# Altium project PCB_Project_MPPT.PrjPcb
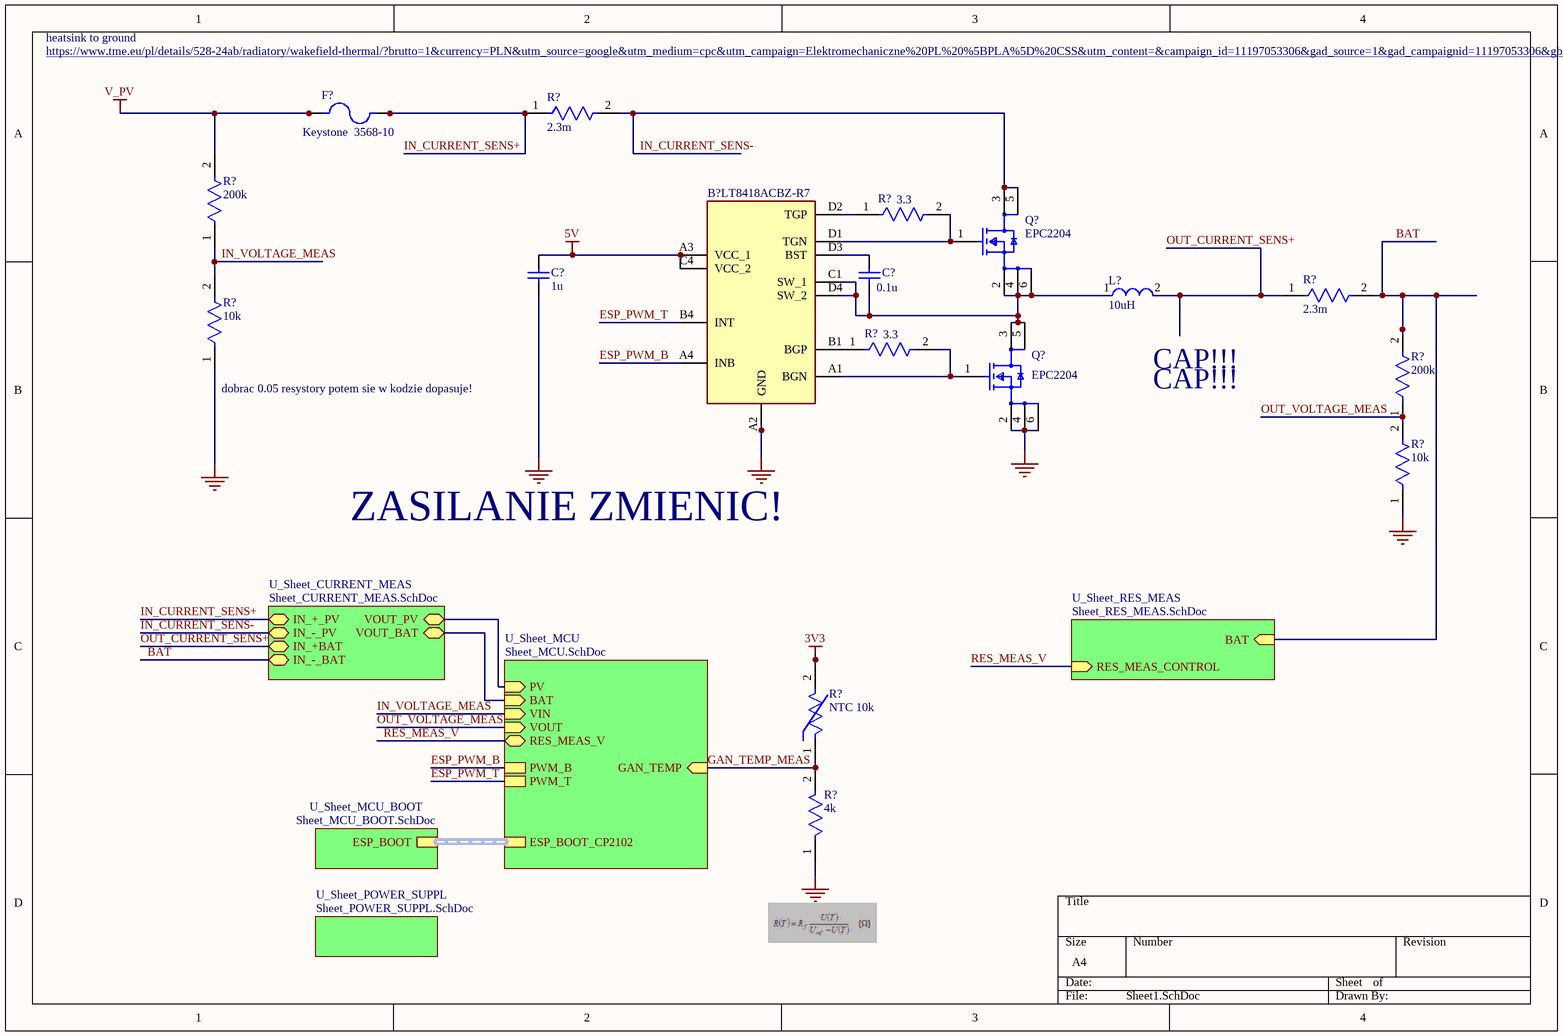
[diagram p0: Sheet1.SchDoc]
7 sheets, 71 parts. Net scope: hierarchical (ports join the sheet entries above them; power ports are global).
Sheets:
  Sheet1.SchDoc
    U_Sheet_MCU = Sheet_MCU.SchDoc
    U_Sheet_MCU_BOOT = Sheet_MCU_BOOT.SchDoc
    U_Sheet_CURRENT_MEAS = Sheet_CURRENT_MEAS.SchDoc
    U_Sheet_POWER_SUPPL = Sheet_POWER_SUPPL.SchDoc
    U_Sheet_RES_MEAS = Sheet_RES_MEAS.SchDoc
  Scheet_MCUBOOT_esp32s3.SchDoc

## Sheet Sheet1.SchDoc
size A4; SheetNumber: 1; SheetTotal: 7

### Parts
(Parts that share a designator on the sheet are numbered #1, #2 ... from top to bottom, then left to right.)
B?#1  LT8418ACBZ-R7  [BGA12C40P4X4_167X167X56]
C?#1  1u  [CAPC2013X140X50LL20T25]
C?#2  0.1u  [CAPC2013X140X45LL15T25]
F?  Keystone  3568-10  [FUSE_3568-10]
L?#1  10uH  [FP-IHLP-5050EZ-FP_3_226x4-MFG]
Q?#1  EPC2204  [FP-EPC2204-MFG]
Q?#2  EPC2204  [FP-EPC2204-MFG]
R?#1  2.3m  [FP-WSLF2512-1_02-MFG]
R?#2  3.3  [FP-ESR10-IPC_A]
R?#3  200k  [FP-RT0805-MFG]
R?#4  2.3m  [FP-WSLF2512-1_02-MFG]
R?#5  3.3  [FP-ESR10-IPC_A]
R?#6  10k  [FP-RT0805-MFG]
R?#7  200k  [FP-RT0805-MFG]
R?#8  10k  [FP-RT0805-MFG]
R?#9  NTC 10k  [FP-NCP21-0_2-IPC_C]
R?#10  4k  [FP-RN732A-MFG]

### Sub-sheets
U_Sheet_CURRENT_MEAS = Sheet_CURRENT_MEAS.SchDoc: IN_+_PV (bidir), IN_-_PV (bidir), IN_+BAT (bidir), IN_-_BAT (bidir), VOUT_PV (bidir), VOUT_BAT (bidir)
U_Sheet_MCU = Sheet_MCU.SchDoc: ESP_BOOT_CP2102 (harness ESP_BOOT_CP2102), PV (in), VIN (in), VOUT (in), BAT (in), RES_MEAS_V (bidir), PWM_B, PWM_T, GAN_TEMP (in)
U_Sheet_MCU_BOOT = Sheet_MCU_BOOT.SchDoc: ESP_BOOT (harness ESP_BOOT_CP2102)
U_Sheet_POWER_SUPPL = Sheet_POWER_SUPPL.SchDoc: no entries
U_Sheet_RES_MEAS = Sheet_RES_MEAS.SchDoc: RES_MEAS_CONTROL (in), BAT (in)

### Nets
3V3: R?#9.2
5V: B?#1.A3(VCC_1) B?#1.C4(VCC_2) C?#1.2
GND: B?#1.A2(GND) C?#1.1 Q?#2.2(Source) Q?#2.4(Source) Q?#2.6(Source) R?#6.1 R?#8.1 R?#10.1
V_PV: F?.1 F?.3 R?#3.2
BAT: R?#4.2 R?#7.2 ; sheet U_Sheet_CURRENT_MEAS/IN_-_BAT, sheet U_Sheet_RES_MEAS/BAT
ESP_PWM_B: B?#1.A4(INB) ; sheet U_Sheet_MCU/PWM_B
ESP_PWM_T: B?#1.B4(INT) ; sheet U_Sheet_MCU/PWM_T
GAN_TEMP_MEAS: R?#9.1 R?#10.2 ; sheet U_Sheet_MCU/GAN_TEMP
IN_CURRENT_SENS+: F?.2 F?.4 R?#1.1 ; sheet U_Sheet_CURRENT_MEAS/IN_+_PV
IN_CURRENT_SENS-: Q?#1.3(Drain) Q?#1.5(Drain) R?#1.2 ; sheet U_Sheet_CURRENT_MEAS/IN_-_PV
IN_VOLTAGE_MEAS: R?#3.1 R?#6.2 ; sheet U_Sheet_MCU/VIN
OUT_CURRENT_SENS+: L?#1.2 R?#4.1 ; sheet U_Sheet_CURRENT_MEAS/IN_+BAT
OUT_VOLTAGE_MEAS: R?#7.1 R?#8.2 ; sheet U_Sheet_MCU/VOUT
RES_MEAS_V: sheet U_Sheet_MCU/RES_MEAS_V, sheet U_Sheet_RES_MEAS/RES_MEAS_CONTROL  [project net RES_MEAS_CONTROL]
NetB?#1_A1: B?#1.A1(BGN) Q?#2.1(Gate) R?#5.2
NetB?#1_B1: B?#1.B1(BGP) R?#5.1
NetB?#1_C1: B?#1.C1(SW_1) B?#1.D4(SW_2) C?#2.1 L?#1.1 Q?#1.2(Source) Q?#1.4(Source) Q?#1.6(Source) Q?#2.3(Drain) Q?#2.5(Drain)
NetB?#1_D1: B?#1.D1(TGN) Q?#1.1(Gate) R?#2.2
NetB?#1_D2: B?#1.D2(TGP) R?#2.1
NetB?#1_D3: B?#1.D3(BST) C?#2.2
NetU?#2_8: sheet U_Sheet_MCU/PV, sheet U_Sheet_CURRENT_MEAS/VOUT_PV
NetU?#2_9: sheet U_Sheet_MCU/BAT, sheet U_Sheet_CURRENT_MEAS/VOUT_BAT

### Buses and harness runs
harness sheet U_Sheet_MCU/ESP_BOOT_CP2102 = sheet U_Sheet_MCU_BOOT/ESP_BOOT

### Notes on the sheet
- heatsink to ground
- https://www.tme.eu/pl/details/528-24ab/radiatory/wakefield-thermal/?brutto=1&currency=PLN&utm_source=google&utm_medium=cpc&utm_campaign=Elektromechaniczne%20PL%20%5BPLA%5D%20CSS&utm_content=&campaign_id=11197053306&gad_source=1&gad_campaignid=11197053306&gbraid=0AAAAADyylhLZbvY-cskZoRzBLKTwpPTA7&gclid=Cj0KCQiA2bTNBhDjARIsAK89wlHUc6paiocvVZBOlYyiqLQ5ZEe9kHkqtYY_EUCSDrDoMr3ZsjBrI2saAg7CEALw_wcB
- (near L?#1) CAP!!!
- (near R?#6) dobrac 0.05 resystory potem sie w kodzie dopasuje!
- CAP!!!
- ZASILANIE ZMIENIC!

### Library data of the parts
B?#1 = LT8418ACBZ-R7: 100V Half-Bridge GaN Driver with Smart Integrated Bootstrap Switch; Manufacturer_Name: Analog Devices; Geometry.Height: 0.56mm; Manufacturer_Part_Number: LT8418ACBZ-R7; Mouser Part Number: 584-LT8418ACBZ-R7; Mouser Price/Stock: https://www.mouser.co.uk/ProductDetail/Analog-Devices/LT8418ACBZ-R7?qs=mELouGlnn3eZ%252BVjhQJercg%3D%3D; Arrow Part Number: LT8418ACBZ-R7; Arrow Price/Stock: https://www.arrow.com/en/products/lt8418acbz-r7/analog-devices?utm_currency=USD&region=nac; Datasheet Link: https://www.analog.com/LT8418/datasheet
C?#1 = CMP-1036-04749-2: Manufacturer: Kemet; Part Number: C0805C105M4RACTU
C?#2 = CMP-2007-03344-1: Part Number: GCM21BR71E104KA37L; Manufacturer: Murata
F? = 3568-10: Holder,THM-Vertical Entry,Mini Automotive Fuse Holder,30 Amps,1 Fuse,Red | Keystone Electronics 3568-10; SnapEDA_Link: https://www.snapeda.com/parts/3568-10/Keystone/view-part/?ref=snap; Package: None; Value: *; MF: Keystone; MP: 3568-10; Check_prices: https://www.snapeda.com/parts/3568-10/Keystone/view-part/?ref=eda
L?#1 = CMP-02424-000353-1: Commercial Inductors, High Saturation Series 10uH 9A 25.5mΩ 20%; Self Resonant Frequency: 5MHz; DC Resistance (DCR): 25.5mR; Max DC Current: 16A; Core Material: Metal; Shielding: Shielded; Test Frequency: 100kHz; Height: 5mm; Width: 12.9mm; Current Rating: 9A; Number of Pins: 2; Inductance Tolerance: 20%; Min Operating Temperature: -55°C; RMS Current (Irms): 9A; Radiation Hardening: No; Height - Seated (Max): 0.197inch; Length: 13.2mm; Saturation Current: 16A; Case/Package: 5050; Termination: SMD/SMT; Inductance: 10uH; Package Quantity: 250; Mount: Surface Mount; Packaging: Tape and Reel; Lead Free: Lead Free; Military Standard: Not; Tolerance: 20%; Depth: 12.9mm; Max Operating Temperature: 125°C
Q?#1 Q?#2 = CMP-166566-000012-1: TRANS GAN 100V DIE 5.6MOHM; RoHS Compliant: Yes
R?#1 R?#4 = CMP-00030-75451314-1: WSLF2512L3000FEA Res Metal Strip 2512 0.0003 Ohm 1% 6W ±200ppm/C Sulfur Resistant Pad SMD Automotive T/R; Power Rating: 10W; Resistance: 300µΩ; Temperature Coefficient: 200ppm/°C; Length: 6.35mm; Case/Package: 2512; NexarPartId: 75451314; Case Code (Imperial): 2512; RoHS: Compliant; Packaging: Cut Tape; Width: 3.175mm; Max Power Dissipation: 6W; Features: Moisture Resistant; Min Operating Temperature: -65°C; Schedule B: 8533210045, 8533210045; Max Operating Temperature: 170°C; Lead Free: Lead Free; Case Code (Metric): 6432; Composition: Metal Element; Number of Terminations: 2; Height: 609.6µm; Tolerance: 1%
R?#2 R?#5 = CMP-08839-000011-1: RES SMD 3.3 OHM 5% 0.4W 0805; Temperature Coefficient: 200ppm/°C; Max Power Dissipation: 400mW; Resistance: 3.3R; Lead Free: Lead Free; Number of Terminations: 2; Case Code (Imperial): 0805; Width: 0.049inch; Tolerance: 5%; Height: 0.026inch; Features: Automotive AEC-Q200; Package Quantity: 1; Case/Package: 0805; Min Operating Temperature: -55°C; Case Code (Metric): 2012; Composition: Thick Film; Length: 0.079inch; Max Operating Temperature: 155°C; Packaging: Tape and Reel
R?#3 R?#7 = CMP-2001-01542-2: RES 200K OHM 1/8W .1% SMD 0805; Manufacturer Part Number: RT0805BRE07200KL; Manufacturer: Yageo; Temperature Coefficient: 50 ppm/°C; Power Rating: 0.125W; Value: 200KΩ; Voltage Rating: 150V; Tolerance: 0.0025; Package: RT0805; Height: 0.6mm; Lead Free: Yes; Digikey Description: RES 200K OHM 1/8W .1% SMD 0805; Footprint Url: http://www.yageo.com/exep/pages/download/literatures/PYu-R_Mount_10.pdf; Temperature Range High: +155°C; ComponentLink2URL: http://www.yageo.com/documents/recent/PYu-RT_1-to-0.01_RoHS_L_9.pdf; Category: Res; ComponentLink2Description: Datasheet; Series: RT; Resistance: 200KΩ; Device Class L3: Chip SMD Resistors; Device Class L1: Passive Components; Composition: Thin Film; Ipc Land Pattern Name: RESC200125X50; Automotive: No; RoHS: TRUE; Octopart: https://octopart.com/rt0805bre07200kl-yageo-1220506; Temperature Range Low: -55°C; Temperature: -55°C to +155°C; Device Class L2: Resistors
R?#6 R?#8 = CMP-03412-013123-1: RES SMD 10K OHM 0.25% 1/8W 0805; Manufacturer Part Number: RT0805CRD0710KL; Manufacturer: Yageo; Value: 10KΩ; Voltage Rating: 150V; Tolerance: 0.005; Power Rating: 0.125W; Temperature Coefficient: 25 ppm/°C; Composition: Thin Film; Device Class L3: Chip SMD Resistors; Automotive: No; ComponentLink2Description: Datasheet; RoHS: TRUE; Temperature Range Low: -55°C; Footprint Url: http://www.yageo.com/exep/pages/download/literatures/PYu-R_Mount_10.pdf; Temperature Range High: +155°C; Digikey Description: RES SMD 10K OHM 0.25% 1/8W 0805; ComponentLink2URL: http://www.yageo.com/documents/recent/PYu-RT_1-to-0.01_RoHS_L_9.pdf; Octopart: https://octopart.com/rt0805crd0710kl-yageo-1253059; Device Class L2: Resistors; Lead Free: Yes; Height: 0.6mm; Temperature: -55°C to +155°C; Resistance: 10KΩ; Series: RT; Ipc Land Pattern Name: RESC200125X50; Category: Res; Device Class L1: Passive Components; Package: RT0805
R?#9 = CMP-2000-06827-2: THERMISTOR NTC 10KOHM 3900K 0805; Accuracy: 3%; Current Rating: 440uA; Power Rating: 200mW; Resistance: 10kR; Tolerance: 5%; Number of Pins: 2; Termination: SMD/SMT; Lead Free: Lead Free; Radiation Hardening: No; Mount: Surface Mount; Case Code (Metric): 2012; Depth: 1.25mm; Max Operating Temperature: 125°C; Height: 0.85mm; Case Code (Imperial): 0805; Package Quantity: 4000; Length: 2mm; Case/Package: 0805; Min Operating Temperature: -40°C; Packaging: Tape and Reel; Max Power Dissipation: 200mW; Thickness: 150um; REACH SVHC: No SVHC
R?#10 = CMP-03211-001183-1: SMD Chip Resistor, Thin Film, 22.1KΩ, 100 V, 0805 [2012 Metric], 100 mW, 0.1%, RN73 Series; Manufacturer Part Number: RN73C2A22K1BTDF; Manufacturer: TE Connectivity; Power Rating: 0.1W; Temperature Coefficient: 10ppm/°C; Voltage Rating: 100V; Package: RN732A; Lead Free: Yes; ComponentLink2URL: https://www.te.com/commerce/DocumentDelivery/DDEController?Action=showdoc&DocId=Data+Sheet%7F1773270%7FP%7Fpdf%7FEnglish%7FENG_DS_1773270_P.pdf%7F1676162-2; Temperature Range High: 155°C; Series: RN73; packaging: 1000 Reel; RoHS: TRUE; Automotive: No; Composition: Thin Film; Resistance: 22.1KΩ; Ipc Land Pattern Name: RESC200125X55; Category: Res; octopart_url: https://octopart.com/rn73c2a22k1btdf-te+connectivity-41129296; Device Class L2: Resistors; Device Class L3: Chip SMD Resistors; Value: 22.1KΩ; Device Class L1: Passive Components; Height: 0.65mm; Temperature Range Low: -55°C; ComponentLink2Description: Datasheet; Octopart: https://octopart.com/rn73c2a22k1btdf-te+connectivity-41129296; Tolerance: 0.1%; Temperature: -55°C to 155°C

## Sheet Sheet_MCU.SchDoc
size A4; SheetNumber: 2; SheetTotal: 5
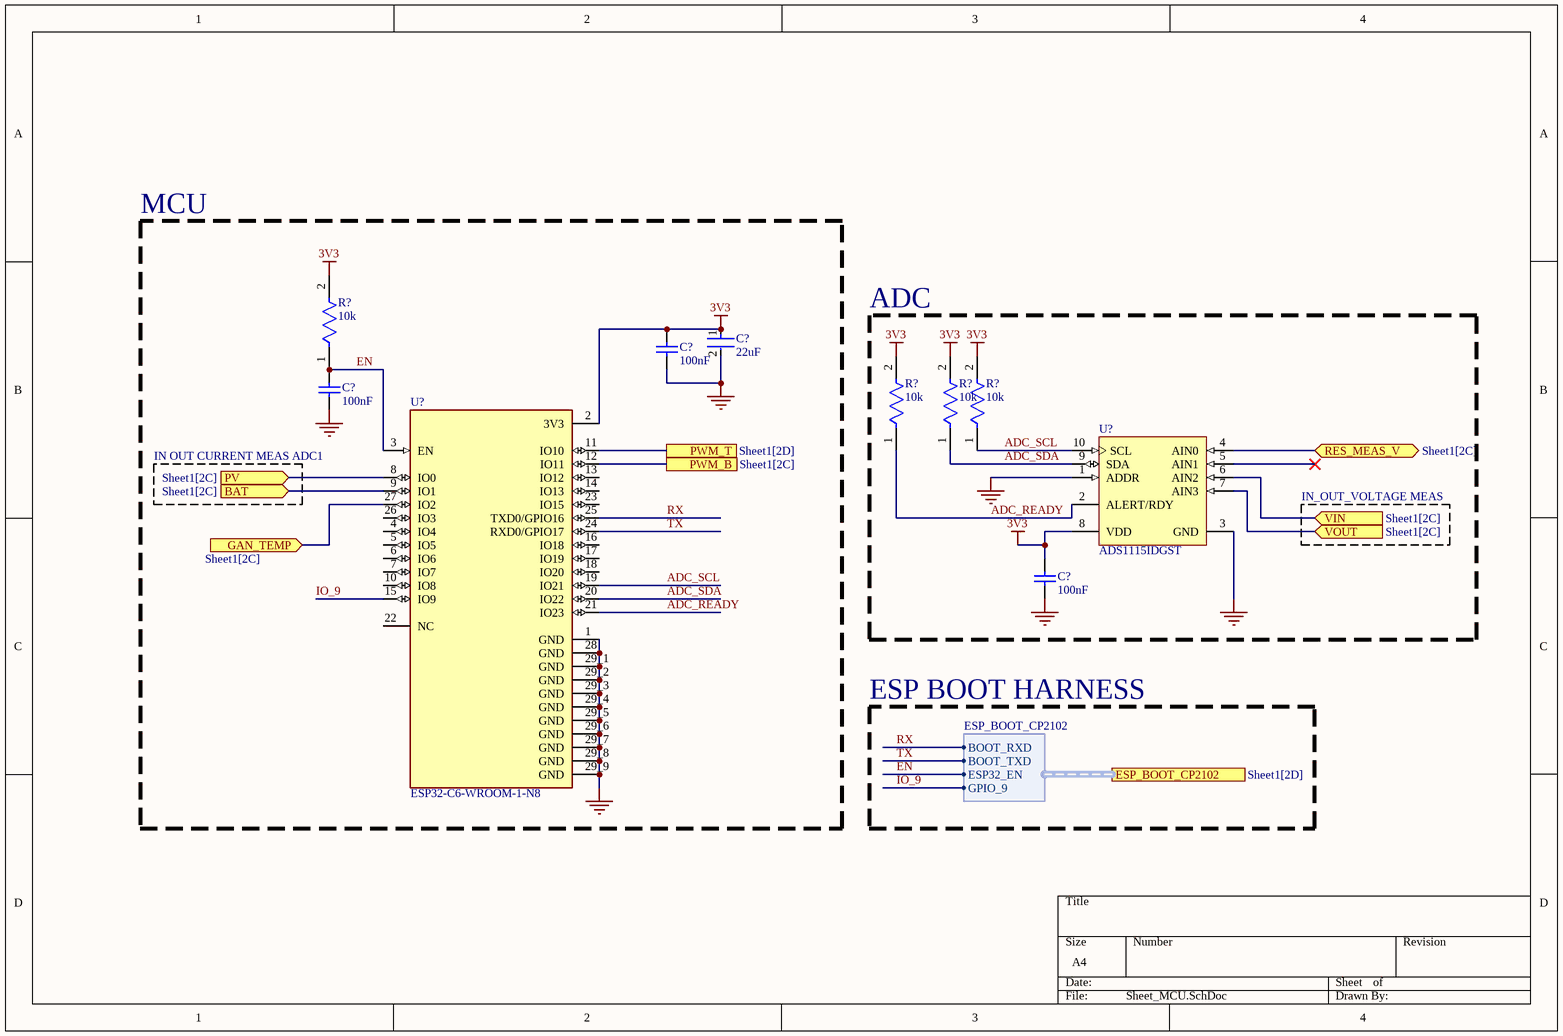
[diagram p1: Sheet_MCU.SchDoc]

### Parts
(Parts that share a designator on the sheet are numbered #1, #2 ... from top to bottom, then left to right.)
C?#3  22uF  [FP-0805-L_2_0_0_2-W_1_25-IPC_A]
C?#4  100nF  [CAPC2013X140X45LL15T25]
C?#5  100nF  [CAPC2013X140X45LL15T25]
C?#6  100nF  [CAPC2013X140X45LL15T25]
R?#11  10k  [FP-RT0805-MFG]
R?#12  10k  [FP-RT0805-MFG]
R?#13  10k  [FP-RT0805-MFG]
R?#14  10k  [FP-RT0805-MFG]
U?#1  ADS1115IDGST  [TI-DGS10_M]
U?#2  ESP32-C6-WROOM-1-N8  [XCVR_ESP32-C6-WROOM-1-N8]

### Blocks framed on the sheet
MCU: C?#3-C?#5 R?#11 U?#2
ADC: C?#6 R?#12-R?#14 U?#1

### Ports
BAT (in, see Sheet1[2C]), ESP_BOOT_CP2102 (harness ESP_BOOT_CP2102, see Sheet1[2D]), GAN_TEMP (in, see Sheet1[2C]), PV (in, see Sheet1[2C]), PWM_B (see Sheet1[2C]), PWM_T (see Sheet1[2D]), RES_MEAS_V (bidir, see Sheet1[2C]), VIN (in, see Sheet1[2C]), VOUT (in, see Sheet1[2C])

### Harnesses
ESP_BOOT_CP2102: BOOT_RXD, BOOT_TXD, ESP32_EN, GPIO_9

### Nets
3V3: C?#3.1 C?#4.2 C?#6.2 R?#11.2 R?#12.2 R?#13.2 R?#14.2 U?#1.8(VDD) U?#2.2(3V3)
GND: C?#3.2 C?#4.1 C?#5.1 C?#6.1 U?#1.1(ADDR) U?#1.3(GND) U?#2.1(GND) U?#2.28(GND) U?#2.29_1(GND) U?#2.29_2(GND) U?#2.29_3(GND) U?#2.29_4(GND) U?#2.29_5(GND) U?#2.29_6(GND) U?#2.29_7(GND) U?#2.29_8(GND) U?#2.29_9(GND)
ADC_READY: R?#12.1 U?#1.2(ALERT/RDY) U?#2.21(IO23)
ADC_SCL: R?#14.1 U?#1.10(SCL) U?#2.19(IO21)
ADC_SDA: R?#13.1 U?#1.9(SDA) U?#2.20(IO22)
EN: C?#5.2 R?#11.1 U?#2.3(EN) ; port ESP_BOOT_CP2102.ESP32_EN
ESP_PWM_B: U?#2.12(IO11) ; port PWM_B
ESP_PWM_T: U?#2.11(IO10) ; port PWM_T
GAN_TEMP_MEAS: U?#2.27(IO2) ; port GAN_TEMP
IN_VOLTAGE_MEAS: U?#1.6(AIN2) ; port VIN
IO_9: U?#2.15(IO9) ; port ESP_BOOT_CP2102.GPIO_9  [project net GPIO_9]
OUT_VOLTAGE_MEAS: U?#1.7(AIN3) ; port VOUT
RES_MEAS_CONTROL: U?#1.4(AIN0) ; port RES_MEAS_V
RX: U?#2.25(TXD0/GPIO16) ; port ESP_BOOT_CP2102.BOOT_RXD  [project net BOOT_RXD]
TX: U?#2.24(RXD0/GPIO17) ; port ESP_BOOT_CP2102.BOOT_TXD  [project net BOOT_TXD]
NetU?#2_8: U?#2.8(IO0) ; port PV
NetU?#2_9: U?#2.9(IO1) ; port BAT

Not connected (* = marked no-connect by the designer): U?#1 5(AIN1)*; U?#2 4(IO4) 5(IO5) 6(IO6) 7(IO7) 10(IO8) 13(IO12) 14(IO13) 16(IO18) 17(IO19) 18(IO20) 22(NC) 23(IO15) 26(IO3)

### Notes on the sheet
- IN OUT CURRENT MEAS ADC1
- IN_OUT_VOLTAGE MEAS
- ESP BOOT HARNESS

### Library data of the parts
C?#3 = CMP-14477-000140-3: Multilayer Ceramic Capacitor 22uF 16V X5R 20% SMD 0805 T/R; Resistor Type: Ceramic; Packaging: Tape and Reel; Height: 1.25mm; RoHS Compliant: Yes; Case Code (Metric): 2012; Series: M; Dielectric: X5R; Max Operating Temperature: 85°C; Voltage Rating: 16V; Width: 0.039inch; Capacitance: 22uF; Min Operating Temperature: -55°C; Thickness: 0.049inch; Termination: SMD/SMT; Construction: Flat; Voltage Rating (DC): 16V; Package Quantity: 1; Tolerance: 20%; Case Code (Imperial): 0805; Length: 2mm; Mount: Surface Mount; Halogen Free: Halogen Free; Case/Package: 0805
C?#4-C?#6 = CMP-2007-03344-1: as C?#2 on sheet Sheet1
R?#11-R?#14 = CMP-03412-013123-1: as R?#6 on sheet Sheet1; Composition: Thin Film; Device Class L3: Chip SMD Resistors; Automotive: No; ComponentLink2Description: Datasheet; RoHS: TRUE; Temperature Range Low: -55°C; Footprint Url: http://www.yageo.com/exep/pages/download/literatures/PYu-R_Mount_10.pdf; Temperature Range High: +155°C; Digikey Description: RES SMD 10K OHM 0.25% 1/8W 0805; ComponentLink2URL: http://www.yageo.com/documents/recent/PYu-RT_1-to-0.01_RoHS_L_9.pdf; Octopart: https://octopart.com/rt0805crd0710kl-yageo-1253059; Device Class L2: Resistors; Lead Free: Yes; Height: 0.6mm; Temperature: -55°C to +155°C; Resistance: 10KΩ; Series: RT; Ipc Land Pattern Name: RESC200125X50; Category: Res; Device Class L1: Passive Components; Package: RT0805
U?#1 = CMP-0003-00378-2: 16-Bit ADC with Integrated Multiplexer, PGA, Comparator, Oscillator, and Reference, -40 to 125 degC, 10-pin SOP (DGS10), Green (RoHS & no Sb/Br); Manufacturer: Texas Instruments; Sample Rate (max)(SPS): 860; SubFamily: Precision ADC (<=10MSPS); Architecture: Delta-Sigma; Digital Supply(Min)(V): 2; Resolution(Bits): 16; Digital Supply(Max)(V): 5.5; INL(Max)(+/-LSB): 1; Interface: Serial I2C; # Input Channels: 4; Eco-Plan: Green (RoHS & no Sb/Br); PackageDescription: 10-Pin Plastic Small Outline, Body 3 x 3 mm, Pitch 0.5 mm; Mounting Technology: Surface Mount; PackageReference: DGS10; DatasheetVersion: SBAS444B; ComponentLink3Description: Package Specification; ComponentLink1Description: Manufacturer URL; PartNumber: ADS1115IDGST; ComponentLink3URL: http://www.ti.com/lit/ml/mpds035b/mpds035b.pdf; ComponentLink2URL: http://www.ti.com/general/docs/lit/getliterature.tsp?genericPartNumber=ADS1115&fileType=pdf; Analog Voltage AV/DD(Min)(V): 2; ComponentLink2Description: Datasheet; PackageVersion: 4073272/C, 02/2004; Analog Voltage AV/DD(Max)(V): 5.5; Code_JEDEC: MO-153; ComponentLink1URL: http://www.ti.com/
U?#2 = ESP32-C6-WROOM-1-N8: Multiprotocol Modules ESP32-C6 module, Wi-Fi 6 in 2.4 GHz band, Bluetooth 5, Zigbee 3.0 and Thread. ESP34-WROOM Compatible - ENGINEERING SAMPLE; MF: Espressif Systems; SnapEDA_Link: https://www.snapeda.com/parts/ESP32-C6-WROOM-1-N8/Espressif+Systems/view-part/?ref=snap; Package: SMD-28 Espressif Systems; Value: *; MP: ESP32-C6-WROOM-1-N8; Check_prices: https://www.snapeda.com/parts/ESP32-C6-WROOM-1-N8/Espressif+Systems/view-part/?ref=eda

## Sheet Sheet_MCU_BOOT.SchDoc
size A4; SheetNumber: 3; SheetTotal: 5
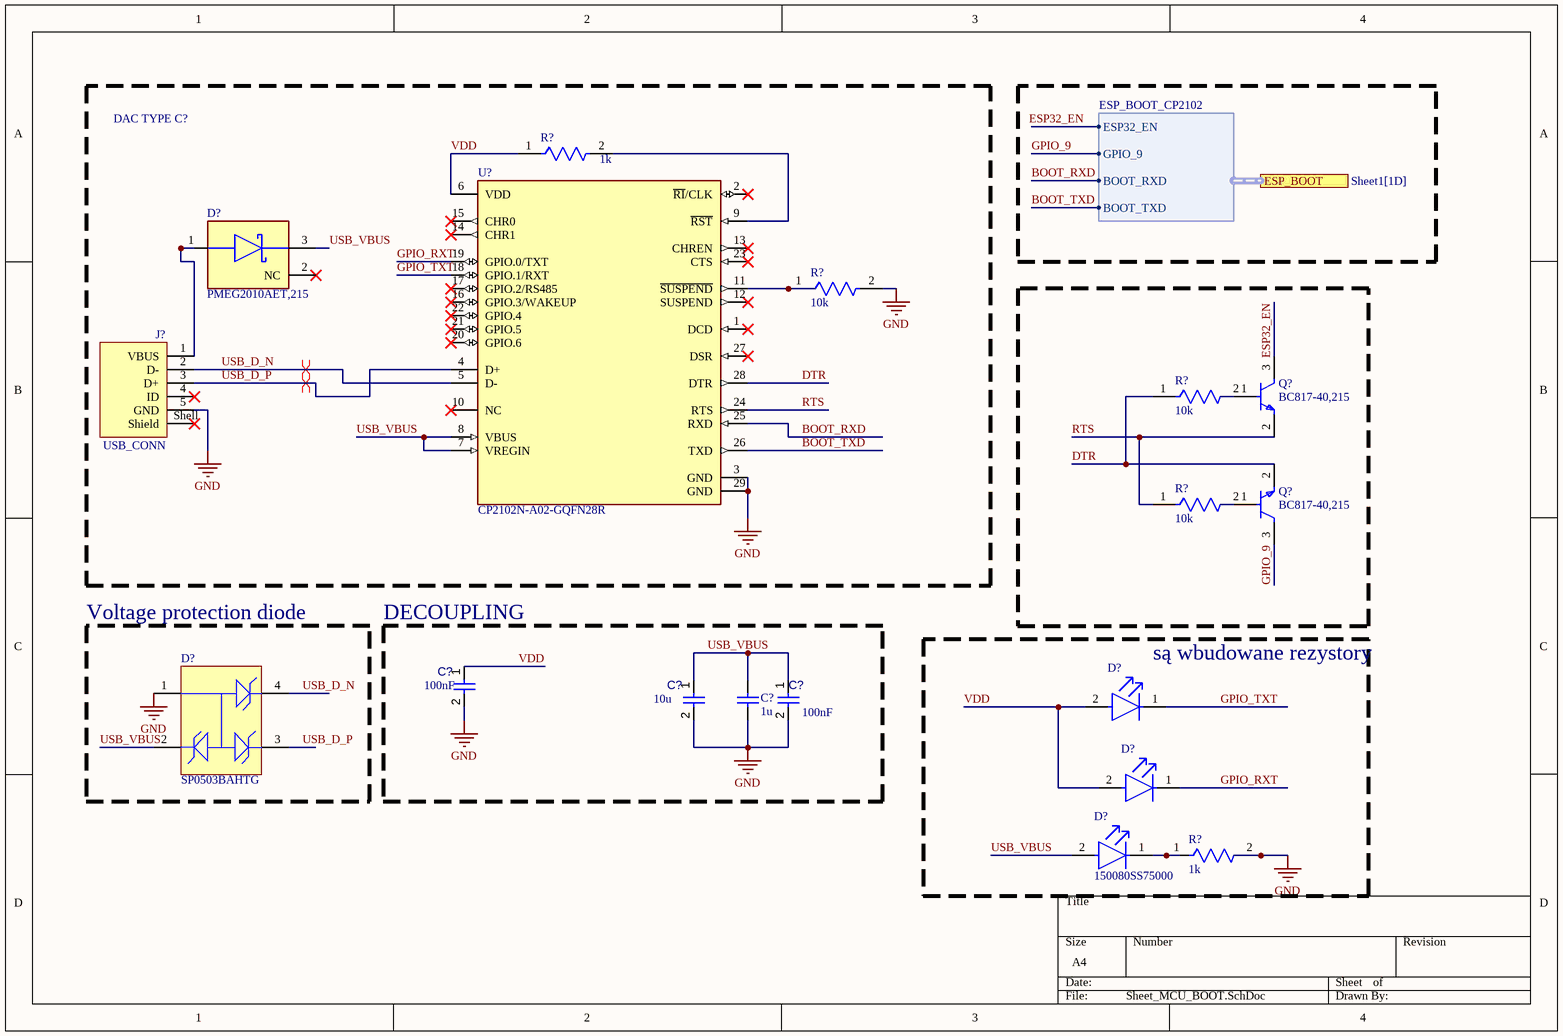
[diagram p2: Sheet_MCU_BOOT.SchDoc]

### Parts
(Parts that share a designator on the sheet are numbered #1, #2 ... from top to bottom, then left to right.)
C?#7  value 100nF  [CAPC2013X95X50LL10T25]  (hidden comment: Capacitor 100 nF +/-10% 50 V 0805)
C?#8  value 10u  [CAPC2013X95X50LL10T25]  (hidden comment: Capacitor 100 nF +/-10% 50 V 0805)
C?#9  value 100nF  [CAPC2013X95X50LL10T25]  (hidden comment: Capacitor 100 nF +/-10% 50 V 0805)
C?#10  1u  [CAPC2013X140X50LL20T25]
D?#1  PMEG2010AET,215  [FP-SOT23-MFG]
D?#2  SP0503BAHTG  [LFUS-SOT143-4_V]
D?#3  LTST-C170GKT  [FP-LTST-C170GKT-MFG]  (value not drawn)
D?#4  APHCM2012SYCK-F01  [FP-APHCM2012SYCK-F01-MFG]  (value not drawn)
D?#5  150080SS75000  [FP-150080SS75000-MFG]
J?  USB_CONN  [651305142821]
Q?#3  BC817-40,215  [FP-SOT23-MFG]
Q?#4  BC817-40,215  [FP-SOT23-MFG]
R?#15  1k  [FP-AF0805-IPC_A]
R?#16  10k  [FP-RN732A-MFG]
R?#17  10k  [FP-RN732A-MFG]
R?#18  10k  [FP-RN732A-MFG]
R?#19  1k  [FP-RN732A-MFG]
U?#3  CP2102N-A02-GQFN28R  [FP-CP2102N-A02-GQFN28R-IPC_A]

### Blocks framed on the sheet
Voltage protection diode: D?#2
DECOUPLING: C?#7-C?#10
są wbudowane rezystory: D?#3-D?#5 R?#19

### Ports
ESP_BOOT (harness ESP_BOOT_CP2102, see Sheet1[1D])

### Harnesses
ESP_BOOT_CP2102: ESP32_EN, GPIO_9, BOOT_RXD, BOOT_TXD

### Nets
GND: C?#7.2 C?#8.2 C?#9.2 C?#10.1 D?#2.1 J?.5(GND) R?#16.2 R?#19.2 U?#3.3(GND) U?#3.29(GND)
BOOT_RXD: U?#3.25(RXD) ; port ESP_BOOT.BOOT_RXD
BOOT_TXD: U?#3.26(TXD) ; port ESP_BOOT.BOOT_TXD
DTR: Q?#4.2(E) R?#17.1 U?#3.28(DTR)
ESP32_EN: Q?#3.3(C) ; port ESP_BOOT.ESP32_EN  [project net EN]
GPIO_9: Q?#4.3(C) ; port ESP_BOOT.GPIO_9
GPIO_RXT: D?#4.1(C) U?#3.19(GPIO.0/TXT)
GPIO_TXT: D?#3.1(C) U?#3.18(GPIO.1/RXT)
RTS: Q?#3.2(E) R?#18.1 U?#3.24(RTS)
USB_D_N: D?#2.4 J?.2(D-) U?#3.5(D-)
USB_D_P: D?#2.3 J?.3(D+) U?#3.4(D+)
USB_VBUS: C?#8.1 C?#9.1 C?#10.2 D?#1.3(C) D?#2.2 D?#5.2(A) U?#3.7(VREGIN) U?#3.8(VBUS)
VDD: C?#7.1 D?#3.2(A) D?#4.2(A) R?#15.1 U?#3.6(VDD)
NetD?#1_1: D?#1.1(A) J?.1(VBUS)
NetD?#5_1: D?#5.1(C) R?#19.1
NetR?#15_2: R?#15.2 U?#3.9(~{RST})
NetR?#16_1: R?#16.1 U?#3.11(~{SUSPEND})

Not connected (* = marked no-connect by the designer): D?#1 2(NC)*; J? 4(ID)* Shell(Shield)*; Q?#3 1(B); Q?#4 1(B); R?#17 2; R?#18 2; U?#3 1(DCD)* 2(~{RI}/CLK)* 10(NC)* 12(SUSPEND)* 13(CHREN)* 14(CHR1)* 15(CHR0)* 16(GPIO.3/WAKEUP)* 17(GPIO.2/RS485)* 20(GPIO.6)* 21(GPIO.5)* 22(GPIO.4)* 23(CTS)* 27(DSR)*

### Layout directives
differential pair: USB_D_N, USB_D_P

### Notes on the sheet
- DAC TYPE C?
- (near D?#1) ??

### Library data of the parts
C?#7-C?#9 = CMP-001-00018-6: Chip Capacitor, 100 nF, +/- 10%, 50 V, 0805 (2012 Metric); Capacitor Type: Ceramic; Voltage Rating: 50V; Pins: 2; Max Operating Temperature: 125°C; Min Operating Temperature: -55°C; Mounting Technology: SM; Case/Package: 0805; RoHS Compliant: True; Tolerance: 10%
C?#10 = CMP-1036-04749-2: as C?#1 on sheet Sheet1
D?#1 = CMP-14398-000002-1: DIODE SCHOTTKY 20V 1A SOT23; Manufacturer: Nexperia; Description: Diode Schottky 20V 1A Automotive 3-Pin TO-236AB T/R; Max Surge Forward Current: 9A; Automotive Grade: Grade 0; Max Junction Temp: +150°C; Value: 55pF; Peak Reverse Current: 50uA; Reverse Voltage: 20V; Device Class L1: Discrete Semiconductors; Package: SOT23; RoHS: TRUE; Manufacturer Part Number: PMEG2010AET,215; Digikey Description: DIODE SCHOTTKY 20V 1A SOT23; Forward Current: 1A; ComponentLink2URL: https://assets.nexperia.com/documents/data-sheet/PMEG2010AEH_PMEG2010AET.pdf; Lead Free: Yes; Temperature: to +150°C; Category: Diode; Octopart: https://octopart.com/pmeg2010aet%2C215-nexperia-78741406; Ambient Temperature Range Low: -65°C; Height: 1.1mm; ComponentLink2Description: Datasheet; Device Class L2: Diodes; Device Class L3: Schottky Diodes; Capacitance: 55pF; Footprint Url: https://assets.nexperia.com/documents/outline-drawing/SOT23.pdf; Ambient Temperature Range High: +150°C; Automotive: Yes; Temperature Range High: +150°C
D?#2 = CMP-2000-05191-1: TVS Diode Array, 30 pF, 30 KV, -40 to 85 degC, 4-Pin SOT143, RoHS, Tape and Reel; Manufacturer: Littelfuse; Direction Type: Uni-Directional; Product Height (mm): 1.05mm; Leakage Current (Max): 0.1uA; Clamping Voltage (Max): 8V; Reverse Stand-off Voltage: 5.5(Min)V; Configuration: Triple; Working Voltage: 5.5V; Product Length (mm): 3.04mm; Working Voltage (Max): 5.5V(Min); Capacitance Value: 30pF; Rad Hardened: No; Number of Elements: 3; Product Depth (mm): 1.4mm; Operating Temperature Max Deg. C: 85C; Suppressor Type: TVS; Operating Temperature Min Deg. C: -40C; Operating Temp Range: -40Cto85C; Mounting: SurfaceMount; Package / Case: SOT-143; Datasheet Version: Dec-13; Package Type: SOT-143; Packaging: TapeandReel; Pin Count: 3+Tab; Operating Temperature Classification: Industrial; Datasheet URL: https://datasheet.ciiva.com/15143/getdatasheetpartid-116020-15143550.pdf; Manufacturer URL: http://www.littelfuse.com/; Leakage Current: 0.1uA; Mounting Style: SurfaceMount; Clamping Voltage: 8V; Polarity: Uni-Directional
D?#3 = CMP-1674-00002-6: LED GREEN CLEAR SMD; Dominant Wavelength: 569nm; Lens Style: Diffused; Forward Voltage: 2.1V; Number of Elements: 1; Wavelength: 565nm; Luminous Intensity: 6mcd; Test Current: 10mA; Power Dissipation: 100mW; Reverse Voltage: 5V; Forward Current: 30mA; Viewing Angle: 130°; Lens Color: Colorless; Min Operating Temperature: -55°C; Number of Pins: 2; Max Operating Temperature: 85°C; Color: Green; Radiation Hardening: No; Illumination Color: Green; Case Code (Metric): 2012; Lens Transparency: Clear; Case/Package: 0805; Width: 1.25mm; Case Code (Imperial): 0805; Package Quantity: 1; Height: 1.1mm; Depth: 1.25mm; Length: 2mm; Power Rating: 100mW; Lead Free: Lead Free; Number of LEDs: 1; Packaging: Tape and Reel; Mount: Surface Mount; Voltage: 5V
D?#4 = CMP-44529-000064-1: LED YELLOW CLEAR CHIP SMD; Number of LEDs: 1; Luminous Intensity: 150mcd; Dominant Wavelength: 590nm; Test Current: 20mA; Illumination Color: Green; Forward Voltage: 2V; Viewing Angle: 110°; Number of Pins: 2; Packaging: Tape and Reel; Width: 1.25mm; Height: 0.4mm; Lens Color: Clear; RoHS Compliant: Yes; Lead Free: Lead Free; Min Operating Temperature: -40°C; Case Code (Imperial): 0805; Case/Package: 0805; Series: APHCM; Wavelength: 590nm; Max Operating Temperature: 85°C; Length: 2mm; Color: Yellow; Package Quantity: 2000; Mount: Surface Mount; Lens Style: Clear; Forward Current: 20mA; Case Code (Metric): 2012
D?#5 = CMP-004-00035-1: Red 630nm LED Indication - Discrete 1.9V 0805 (2012 Metric)
J? = CMP-1502-03247-3: Wr-com; Right Angle SMT Version 2.0; Ni Usb Connector Receptacle, 30 V AC, 1A; Operating Supply Voltage: 30V; Number of Contacts: 5; Insulation Resistance: 1GΩ; USB Standard: USB 2.0; Contact Resistance: 20mΩ; Min Operating Temperature: -40°C; Current Rating: 1A; Number of Pins: 5; Orientation: Horizontal; Gender: Receptacle; REACH SVHC: Unknown; Features: Shielded; Packaging: Tape and Reel; Max Operating Temperature: 105°C; RoHS: Compliant; Contact Material: Copper; Contact Plating: Gold; Connector Type: USB; Lead Free: Lead Free; Mount: Horizontal, Surface Mount; Termination: SMD/SMT
Q?#3 Q?#4 = CMP-14406-000007-1: TRANS NPN 45V 0.5A SOT23; Manufacturer: Nexperia; Collector Emitter Saturation Voltage: 700mV; Power Dissipation: 250mW; Collector Base Voltage: 50V; Unity Gain Freq: 100MHz; Hfe Max: 600; Rthja Max: 500K/W; Emitter Base Voltage: 5V; Max Collector Current: 500mA; Hfe Testvce: 1V; Automotive Grade: Grade 0; Hfe Min: 250; Max Junction Temp: +150°C; Number Of Npn: 1; Hfe Testic: 100mA; Octopart: https://octopart.com/bc817-40%2C215-nexperia-78739081; Lead Free: Yes; Ipc Land Pattern Name: SOT95P230X100-3; Manufacturer Part Number: BC817-40,215; RoHS: TRUE; Collector Emitter Breakdown Voltage: 45V; Digikey Description: TRANS NPN 45V 0.5A SOT23; ComponentLink2URL: https://assets.nexperia.com/documents/data-sheet/BC817_SER.pdf; Temperature Range High: +150°C; Mouser Description: BC817 Series 45 V 500 mA 250 mW SMT NPN General-Purpose Transistor - SOT-23-; Device Class L3: BJTs; Temperature: to +150°C; Height: 1.1mm; Automotive: Yes; Ambient Temperature Range Low: -65°C; Package: SOT23; Collector Emitter Voltage: 45V; Category: Trans; ComponentLink2Description: Datasheet; Device Class L2: Transistors; Ambient Temperature Range High: +150°C; Number Of Elements: 1; Device Class L1: Discrete Semiconductors; Footprint Url: https://assets.nexperia.com/documents/outline-drawing/SOT23.pdf
R?#15 = CMP-03412-043866-1: Anti-Sulfurated Chip Resistor Automotive Grade 1kΩ 1% 0.125W ±100ppm/°C 0805; Max Power Dissipation: 125mW; Resistance: 1kR; Number of Terminations: 2; Series: AF; Length: 0.079inch; Min Operating Temperature: -55°C; Packaging: Tape and Reel; Features: Moisture Resistant; Tolerance: 1%; Resistor Type: Thick Film; RoHS Compliant: Yes; Case/Package: 0805; Height: 0.024inch; Max Operating Temperature: 155°C; Temperature Coefficient: 100ppm/°C; Width: 0.049inch
R?#16-R?#19 = CMP-03211-001183-1: as R?#10 on sheet Sheet1; Package: RN732A; Lead Free: Yes; ComponentLink2URL: https://www.te.com/commerce/DocumentDelivery/DDEController?Action=showdoc&DocId=Data+Sheet%7F1773270%7FP%7Fpdf%7FEnglish%7FENG_DS_1773270_P.pdf%7F1676162-2; Temperature Range High: 155°C; Series: RN73; packaging: 1000 Reel; RoHS: TRUE; Automotive: No; Composition: Thin Film; Resistance: 22.1KΩ; Ipc Land Pattern Name: RESC200125X55; Category: Res; octopart_url: https://octopart.com/rn73c2a22k1btdf-te+connectivity-41129296; Device Class L2: Resistors; Device Class L3: Chip SMD Resistors; Value: 22.1KΩ; Device Class L1: Passive Components; Height: 0.65mm; Temperature Range Low: -55°C; ComponentLink2Description: Datasheet; Octopart: https://octopart.com/rn73c2a22k1btdf-te+connectivity-41129296; Tolerance: 0.1%; Temperature: -55°C to 155°C
U?#3 = CMP-015-00009-2: USB Bus Controller, CMOS

## Sheet Sheet_CURRENT_MEAS.SchDoc
size A4; SheetNumber: 5; SheetTotal: 5
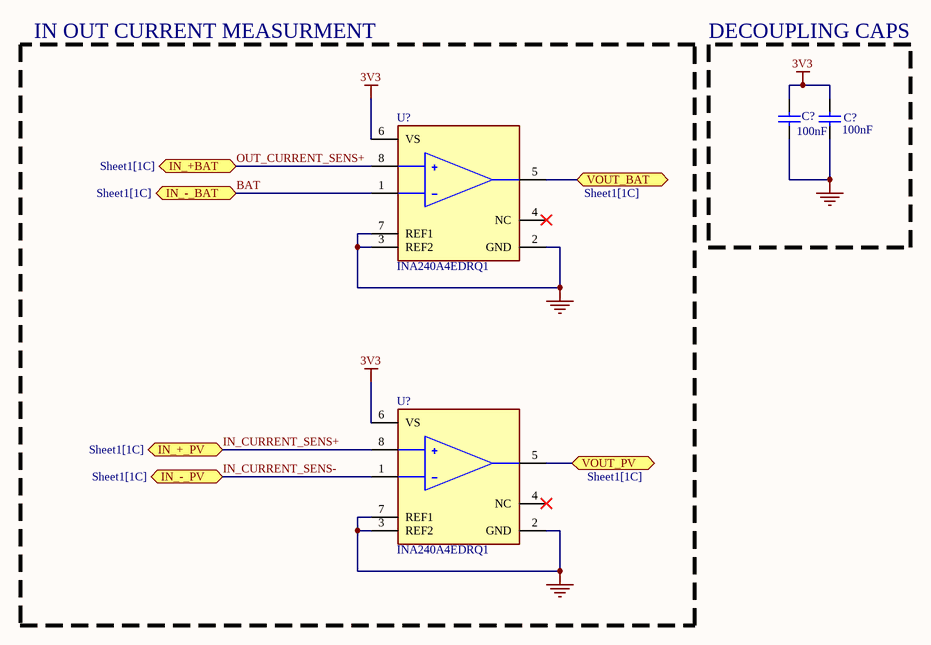
[diagram p3: Sheet_CURRENT_MEAS.SchDoc]

### Parts
(Parts that share a designator on the sheet are numbered #1, #2 ... from top to bottom, then left to right.)
C?#11  100nF  [CAPC2013X140X45LL15T25]
C?#12  100nF  [CAPC2013X140X45LL15T25]
U?#4  INA240A4EDRQ1  [FP-D0008A-IPC_C]
U?#5  INA240A4EDRQ1  [FP-D0008A-IPC_C]

### Blocks framed on the sheet
IN OUT CURRENT MEASURMENT: U?#4 U?#5
DECOUPLING CAPS: C?#11 C?#12

### Ports
IN_+_PV (bidir, see Sheet1[1C]), IN_+BAT (bidir, see Sheet1[1C]), IN_-_BAT (bidir, see Sheet1[1C]), IN_-_PV (bidir, see Sheet1[1C]), VOUT_BAT (bidir, see Sheet1[1C]), VOUT_PV (bidir, see Sheet1[1C])

### Nets
3V3: C?#11.2 C?#12.2 U?#4.6(VS) U?#5.6(VS)
GND: C?#11.1 C?#12.1 U?#4.2(GND) U?#4.3(REF2) U?#4.7(REF1) U?#5.2(GND) U?#5.3(REF2) U?#5.7(REF1)
BAT: U?#4.1(IN-) ; port IN_-_BAT
IN_CURRENT_SENS+: U?#5.8(IN+) ; port IN_+_PV
IN_CURRENT_SENS-: U?#5.1(IN-) ; port IN_-_PV
OUT_CURRENT_SENS+: U?#4.8(IN+) ; port IN_+BAT
NetU?#2_8: U?#5.5(OUT) ; port VOUT_PV
NetU?#2_9: U?#4.5(OUT) ; port VOUT_BAT

Not connected (* = marked no-connect by the designer): U?#4 4(NC)*; U?#5 4(NC)*

### Library data of the parts
C?#11 C?#12 = CMP-2007-03344-1: as C?#2 on sheet Sheet1
U?#4 U?#5 = CMP-04895-000250-1: IC CURR SENSE 1 CIRCUIT 8SOIC; RoHS Compliant: Yes; Max Operating Temperature: 150°C; Min Operating Temperature: -40°C

## Sheet Sheet_POWER_SUPPL.SchDoc
size A4; SheetNumber: 4; SheetTotal: 6
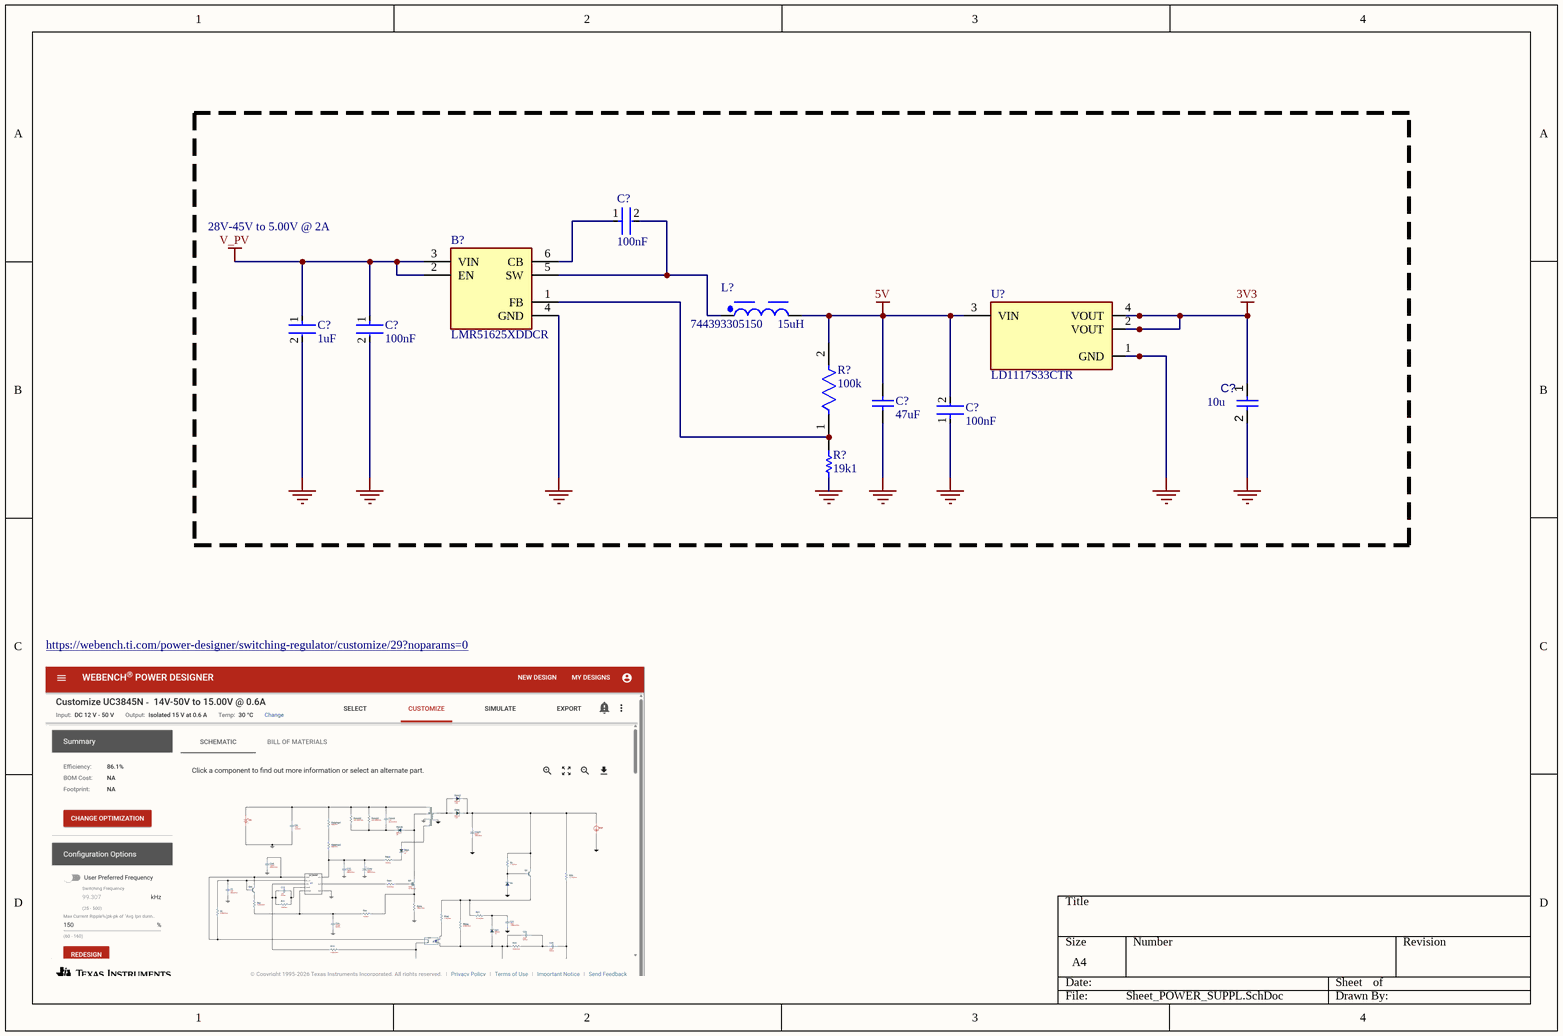
[diagram p4: Sheet_POWER_SUPPL.SchDoc]

### Parts
(Parts that share a designator on the sheet are numbered #1, #2 ... from top to bottom, then left to right.)
B?#2  LMR51625XDDCR  [SOT95P280X110-6N]
C?#13  100nF  [FP-GCM21B-0_15-MFG]
C?#14  1uF  [FP-C2012-125-IPC_B]
C?#15  100nF  [FP-GCM21B-0_15-MFG]
C?#16  value 10u  [CAPC2013X95X50LL10T25]  (hidden comment: Capacitor 100 nF +/-10% 50 V 0805)
C?#17  47uF  [CAPC0805(2012)145_N]
C?#18  100nF  [FP-GCM21B-0_15-MFG]
L?#2  744393305150     15uH  [WE-XHMI_5050]
R?#20  100k  [FP-CRCW0805-e3-IPC_A]
R?#21  19k1  [RESC0805(2012)_M]
U?#6  LD1117S33CTR  [FP-SOT-223-0046067_14-MFG]

### Blocks framed on the sheet
28V-45V to 5.00V @ 2A: B?#2 C?#13-C?#18 L?#2 R?#20 R?#21 U?#6

### Nets
3V3: C?#16.1 U?#6.2(VOUT) U?#6.4(VOUT)
5V: C?#17.2 C?#18.2 L?#2.2 R?#20.2 U?#6.3(VIN)
GND: B?#2.4(GND) C?#14.2 C?#15.2 C?#16.2 C?#17.1 C?#18.1 R?#21.1 U?#6.1(GND)
V_PV: B?#2.2(EN) B?#2.3(VIN) C?#14.1 C?#15.1
NetB?#2_1: B?#2.1(FB) R?#20.1 R?#21.2
NetB?#2_5: B?#2.5(SW) C?#13.2 L?#2.1
NetB?#2_6: B?#2.6(CB) C?#13.1

### Notes on the sheet
- https://webench.ti.com/power-designer/switching-regulator/customize/29?noparams=0

### Library data of the parts
B?#2 = LMR51625XDDCR: Switching Voltage Regulators SIMPLE SWITCHER synchronous buck converter with 4.3V-to-60V, 2.5A and low quiescent current; Manufacturer_Name: Texas Instruments; Geometry.Height: 1.1mm; Manufacturer_Part_Number: LMR51625XDDCR; Mouser Part Number: 595-LMR51625XDDCR; Mouser Price/Stock: https://www.mouser.co.uk/ProductDetail/Texas-Instruments/LMR51625XDDCR?qs=efUn273yAheKjJQ13bmSQQ%3D%3D; Arrow Part Number: LMR51625XDDCR; Arrow Price/Stock: https://www.arrow.com/en/products/lmr51625xddcr/texas-instruments?utm_currency=USD&region=nac; Datasheet Link: https://www.ti.com/lit/ds/symlink/lmr51625.pdf?ts=1740555768028
C?#13 C?#15 C?#18 = CMP-2007-03364-2: Ceramic Capacitor for Automotive 100nF ±10% 100VDC X7R 0805 Embossed T/R; Voltage Rating: 100V; Termination: SMD/SMT; Tolerance: 10%; Case Code (Imperial): 0805; Length: 2mm; Max Operating Temperature: 125°C; Case/Package: 0805; Mount: Surface Mount; Packaging: Tape and Reel; Package Quantity: 1; Min Operating Temperature: -55°C; Case Code (Metric): 2012; Radiation Hardening: No; REACH SVHC: No SVHC; Dielectric: X7R; Depth: 1.25mm; Lead Free: Lead Free; Ratings: AEC-Q200; Height: 1.25mm; Voltage: 100V; Capacitance: 100nF; Voltage Rating (DC): 100V; Width: 0.049inch; Thickness: 0.055inch
C?#14 = CMP-08246-004333-1: CAP CER 1UF 100V X7S 0805; Tolerance: 10%; Case Code (Metric): 2012; Resistor Type: Ceramic; Voltage Rating (DC): 100V; RoHS Compliant: Yes; Mount: Surface Mount; Min Operating Temperature: -55°C; Voltage Rating: 100V; Series: C; Width: 0.05inch; Max Operating Temperature: 125°C; Height: 1.25mm; Capacitance: 1uF; Length: 2mm; Dielectric: X7S; Case/Package: 0805; Packaging: Tape and Reel; Features: Soft Termination; Lead Free: Lead Free; Case Code (Imperial): 0805; Thickness: 0.049inch; Termination: SMD/SMT; Package Quantity: 1; Depth: 1.25mm
C?#16 = CMP-001-00018-6: as C?#7 on sheet Sheet_MCU_BOOT; Pins: 2; Max Operating Temperature: 125°C; Min Operating Temperature: -55°C; Mounting Technology: SM; Case/Package: 0805; RoHS Compliant: True; Tolerance: 10%
C?#17 = CMP-1036-04950-1: CAP 47uF 6.3V ±20% 0805 (2012 Metric) Thickness 1.45mm SMD; Case-EIA: 0805; Case-Metric: 2012; Tolerance: Â±20%; Technology: SMT; Value: 47uF; Max Thickness: 1.45 mm; Rated Voltage: 6.3 V
L?#2 = CMP-03913-148605666-1: Power Inductor, 15UH, Shielded, 4A Rohs Compliant: Yes
R?#20 = CMP-02407-006346-1: RES Thick Film, 100kΩ, 1%, 0.125W, 100ppm/°C, 0805; Resistance: 100kR; Max Power Dissipation: 125mW; Max Operating Temperature: 155°C; Lead Free: Lead Free; Temperature Coefficient: 100ppm/°C; Radiation Hardening: No; Military Standard: Not; Height: 0.02inch; Contact Plating: Tin; Length: 0.079inch; Tolerance: 1%; Composition: Thick Film; Case/Package: 0805; Package Quantity: 20000; Width: 0.049inch; Depth: 1.25mm; Features: Automotive AEC-Q200; Number of Terminations: 2; Packaging: Tape and Reel; Min Operating Temperature: -55°C
R?#21 = CMP-1013-00653-1: 19K1 0.125W 1% 0805 (2012 Metric)  SMD; Value: 19100.00 Ohm; Case-EIA: 0805; Case-Metric: 2012; Power: 0.125 W; Tolerance: 1 %; Technology: SMT
U?#6 = CMP-0244-00307-2: IC REG LINEAR 3.3V 800MA SOT223; Input Bias Current: 5mA; Output Voltage Accuracy: 1%; Dropout Voltage: 1.1V; Power Dissipation: 12W; Polarity: Positive; Min Input Voltage: 5.3V; Quiescent Current: 10mA; Max Output Current: 1.3A; Output Current: 950mA; Number of Regulators: 1; Max Supply Voltage: 15V; Output Type: Fixed; Output Voltage: 3.3V; Number of Terminals: 4; Min Supply Voltage: 3.3V; Termination: SMD/SMT; Mount: Surface Mount; Max Power Dissipation: 12W; Case/Package: SOT-223; Lead Free: Lead Free; Height: 1.8mm; REACH SVHC: No SVHC; Radiation Hardening: No; Width: 3.5mm; Length: 6.5mm; Packaging: Tape and Reel; Max Input Voltage: 15V; Accuracy: 1%; Weight: 0.01lb; Contact Plating: Tin; Max Operating Temperature: 125°C; Number of Pins: 4; Max Output Voltage: 3.3V; Min Operating Temperature: -40°C; Nominal Output Voltage: 3.3V; Package Quantity: 1; Min Output Voltage: 3.3V; Number of Outputs: 1

## Sheet Sheet_RES_MEAS.SchDoc
size A4; SheetNumber: 6; SheetTotal: 7
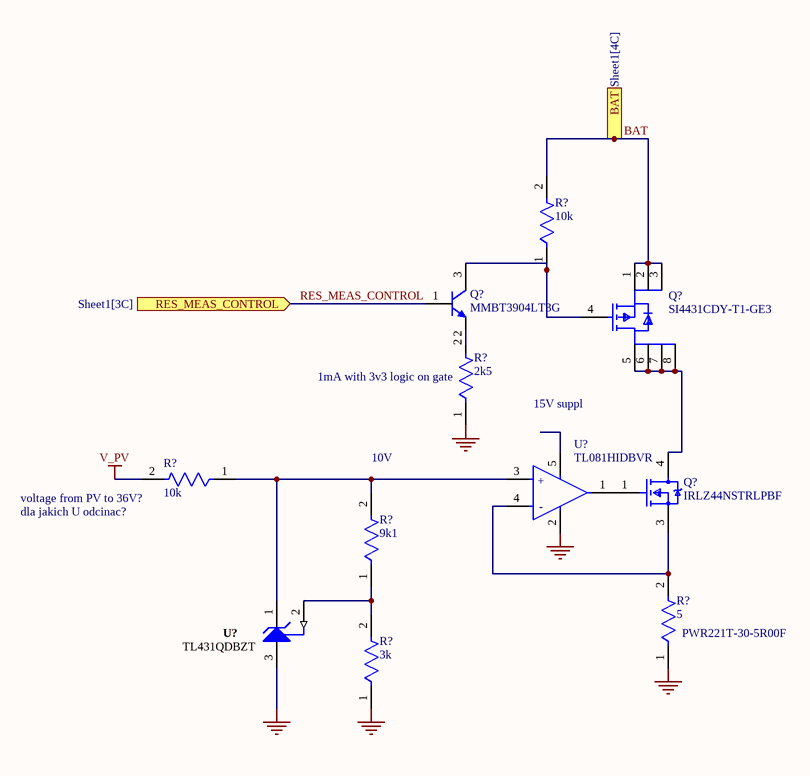
[diagram p5: Sheet_RES_MEAS.SchDoc]

### Parts
(Parts that share a designator on the sheet are numbered #1, #2 ... from top to bottom, then left to right.)
Q?#5  MMBT3904LT3G  [ONSC-SOT-23-3-318-08_V]
Q?#6  SI4431CDY-T1-GE3  [FP-C-06527-MFG]
Q?#7  IRLZ44NSTRLPBF  [FP-PG-TO263-3-MFG]
R?#22  10k  [FP-RT0805-MFG]
R?#23  2k5  [FP-AC0805-MFG]
R?#24  10k  [FP-RT0805-MFG]
R?#25  9k1  [FP-RN73R2A-IPC_C]
R?#26  5  [FP-PWR220T-20-MFG]
R?#27  3k  [FP-RN73R1E-IPC_A]
U?#7  TL081HIDBVR  [FP-DBV0005A-MFG]
U?#8  TL431QDBZT  [DBZ0003A_L]

### Ports
BAT (in, see Sheet1[4C]), RES_MEAS_CONTROL (in, see Sheet1[3C])

### Nets
GND: R?#23.1 R?#26.1 R?#27.1 U?#7.2(V-) U?#8.3(ANODE)
V_PV: R?#24.2
BAT: Q?#6.1(S) Q?#6.2(S) Q?#6.3(S) R?#22.2 ; port BAT
RES_MEAS_CONTROL: Q?#5.1(B) ; port RES_MEAS_CONTROL
NetQ?#5_2: Q?#5.2(E) R?#23.2
NetQ?#5_3: Q?#5.3(C) Q?#6.4(G) R?#22.1
NetQ?#6_5: Q?#6.5(D) Q?#6.6(D) Q?#6.7(D) Q?#6.8(D) Q?#7.4(D)
NetQ?#7_1: Q?#7.1(G) U?#7.1(OUT)
NetQ?#7_3: Q?#7.3(S) R?#26.2 U?#7.4(IN-)
NetR?#24_1: R?#24.1 R?#25.2 U?#7.3(IN+) U?#8.1(CATHODE)
NetR?#25_1: R?#25.1 R?#27.2 U?#8.2(REF)

Not connected (* = marked no-connect by the designer): U?#7 5(V+)

### Notes on the sheet
- (near R?#23) 1mA with 3v3 logic on gate
- 15V suppl
- 10V
- (near R?#24) voltage from PV to 36V?
- (near R?#24) dla jakich U odcinac?
- (near R?#26) PWR221T-30-5R00F
- (in symbol CMP-00370-120332668-1) +; -

### Library data of the parts
Q?#5 = CMP-1048-00630-1: General Purpose Transistor, NPN Silicon, 3-Pin SOT-23, Pb-Free, Tape and Reel; Manufacturer: On Semiconductor; fT Min (MHz): 300; IC Continuous (A): 0.2; PackageVersion: Rev. AP, 11/2009; PackageReference: SOT-23-3-318-08; Packing: Tape and Reel; RoHS: TRUE; ComponentLink2Description: Datasheet; PackageDescription: 3-Pin Small Outline Transistor, Body 2.92 x 1.3 mm, Pitch 0.95 mm; PartNumber: MMBT3904LT3G; ComponentLink1Description: Manufacturer URL; ComponentLink3URL: http://www.onsemi.cn/pub_link/Collateral/318-08.PDF; Mounting Technology: Surface Mount; ComponentLink3Description: Package Specification; DatasheetVersion: Rev. 12; ComponentLink1URL: http://www.onsemi.com/; ComponentLink2URL: http://www.onsemi.cn/pub_link/Collateral/MMBT3904LT1-D.PDF; Polarity: NPN
Q?#6 = CMP-02550-000031-1: MOSFET P-CH 30V 9A 8-SOIC; Manufacturer: Vishay; Turn Off Delay Time: 23ns; Max Forward Diode Voltage: -1.2V; Drain To Source Breakdown Voltage: -30V; Number Of P Channels: 1; Standoff Height: 0.1mm; Continuous Drain Current: -7A; Gate To Source Voltage: 20V; Threshold Vgs Min: -1V; Gate Charge At Vgs: 25nC @ -10V; Turn On Delay Time: 10ns; Typ Forward Diode Voltage: -0.71V; Input Capacitace At Vds: 1006pF @ -15V; Reverse Recovery Time: 22ns; Transconductance: 18S; Reverse Recovery Charge: 17nC; Pulse Drain Current: -30A; Threshold Vgs Max: -2.5V; Drain To Source Resistance: 0.026Ω; Power Dissipation: 2.5W; Depletion Mode: False; Rthja Max: 40°C/W; Max Junction Temp: +150°C; Mouser Description: MOSFET 30V 9.0A 4.2W 32mohm @ 10V; Digikey Description: MOSFET P-CH 30V 9A 8-SOIC; Height: 1.75mm; Package: C-06527; Device Class L3: MOSFETs; Temperature Range Low: -55°C; Number Of Channels: 1; Automotive: No; Temperature: -55°C to +150°C; Device Class L2: Transistors; Manufacturer Part Number: SI4431CDY-T1-GE3; Device Class L1: Discrete Semiconductors; Ipc Land Pattern Name: SOIC127P600X155-8; Drain To Source Voltage: -30V; Temperature Range High: +150°C; ComponentLink2URL: http://www.vishay.com/docs/68748/si4431cd.pdf; ComponentLink2Description: Datasheet; Lead Free: Yes; RoHS: TRUE; Octopart: https://octopart.com/si4431cdy-t1-ge3-vishay-44648921; Category: Trans
Q?#7 = CMP-32901-000495-1: MOSFET N-CH 55V 47A D2PAK; Rds On Max: 22mR; Input Capacitance: 1.7nF; Turn-On Delay Time: 11ns; Turn-Off Delay Time: 26ns; Power Dissipation: 110W; Element Configuration: Single; Gate to Source Voltage (Vgs): 16V; Drain to Source Resistance: 35mR; Threshold Voltage: 2V; Max Power Dissipation: 3.8W; Lead Free: Contains Lead; Max Dual Supply Voltage: 55V; Width: 0.38inch; Mount: Surface Mount; Continuous Drain Current (ID): 47A; Min Operating Temperature: -55°C; Number of Pins: 3; REACH SVHC: No SVHC; Height: 0.19inch; Length: 0.42inch; Case/Package: D2PAK; Drain to Source Breakdown Voltage: 55V; Packaging: Tape and Reel; Drain to Source Voltage (Vdss): 55V; Halogen Free: Halogen Free; RoHS Compliant: Yes; Max Operating Temperature: 175°C
R?#22 R?#24 = CMP-03412-013123-1: as R?#6 on sheet Sheet1; Composition: Thin Film; Device Class L3: Chip SMD Resistors; Automotive: No; ComponentLink2Description: Datasheet; RoHS: TRUE; Temperature Range Low: -55°C; Footprint Url: http://www.yageo.com/exep/pages/download/literatures/PYu-R_Mount_10.pdf; Temperature Range High: +155°C; Digikey Description: RES SMD 10K OHM 0.25% 1/8W 0805; ComponentLink2URL: http://www.yageo.com/documents/recent/PYu-RT_1-to-0.01_RoHS_L_9.pdf; Octopart: https://octopart.com/rt0805crd0710kl-yageo-1253059; Device Class L2: Resistors; Lead Free: Yes; Height: 0.6mm; Temperature: -55°C to +155°C; Resistance: 10KΩ; Series: RT; Ipc Land Pattern Name: RESC200125X50; Category: Res; Device Class L1: Passive Components; Package: RT0805
R?#23 = CMP-03412-037614-1: RES SMD 2.2K OHM 5% 1/8W 0805; Manufacturer Part Number: AC0805JR-072K2L; Manufacturer: Yageo; Voltage Rating: 150V; Value: 2.2KΩ; Automotive Grade: Grade 0; Tolerance: 0.05; RoHS: TRUE; Automotive: Yes; Temperature: -55°C to +155°C; Power Rating: 1/8W; Height: 0.6mm; ComponentLink2Description: Datasheet; Temperature Range Low: -55°C; Device Class L1: Passive Components; Package: AC0805; Composition: Thick Film; Device Class L2: Resistors; Ipc Land Pattern Name: RESC200125X50; Lead Free: Yes; Resistance: 2.2KΩ; ComponentLink2URL: http://www.yageo.com/documents/recent/PYu-AC_51_RoHS_L_6.pdf; Mouser Description: Thick Film Resistors - SMD 1/8W 2.2K ohm 5% AEC-Q200; Series: AC; Category: Res; Footprint Url: http://www.yageo.com/exep/pages/download/literatures/PYu-R_Mount_10.pdf; Octopart: https://octopart.com/ac0805jr-072k2l-yageo-30510982; Digikey Description: RES SMD 2.2K OHM 5% 1/8W 0805; Device Class L3: Chip SMD Resistors; Temperature Range High: +155°C
R?#25 = CMP-04015-024559-1: 9.1kΩ ±0.1% 0.125W, 1/8W Chip Resistor 0805 (2012 Metric) Moisture Resistant Thin Film
R?#26 = CMP-07232-000002-1: RES 5 OHM 20W 5% TO220; Manufacturer Part Number: PWR220T-20-5R00J; Manufacturer: Bourns; Temperature Coefficient: 100ppm/°C; Resistance: 5Ω; Automotive Grade: Grade 0; Value: 5Ω; Voltage Rating: 250V; Composition: Thick Film; Tolerance: 5%; Power Rating: 20W; Digikey Description: RES 5 OHM 20W 5% TO220; Octopart: https://octopart.com/pwr220t-20-5r00j-bourns-21273404; Category: Res; Height: 14.98mm; Temperature Range High: +155°C; Device Class L3: Through-Hole Resistors; Series: PWR220T-20; ComponentLink2Description: Datasheet; ComponentLink2URL: https://www.bourns.com/docs/product-datasheets/pwr220t-20.pdf?sfvrsn=85de74b5_4; Mouser Description: Thick Film Resistors POWER RESISTOR 5%; Lead Free: Yes; Temperature: -55°C to +155°C; Package: PWR220T-20; RoHS: TRUE; Temperature Range Low: -55°C; Device Class L2: Resistors; Device Class L1: Passive Components; Automotive: Yes
R?#27 = CMP-04015-017594-1: 3kΩ ±1% 0.063W, 1/16W Chip Resistor 0402 (1005 Metric) Moisture Resistant Thin Film
U?#7 = CMP-00370-120332668-1: Operational Amplifier, 1 Func, 4000uV Offset-Max, BIPolar, PDSO5; Manufacturer Lifecycle Status: ACTIVE; Thickness: 1.2mm; Case/Package: SOT-23; Length: 2.9mm; Schedule B: 8542330000; Lifecycle Status: Production; Number of Pins: 5; Width: 1.6mm; Height: 1.45mm
U?#8 = CMP-0366-01046-2: Adjustable Precision Shunt Regulator, 34 ppm / degC, 100 mA, -40 to 125 degC, 3-pin SOT-23 (DBZ), Green (RoHS & no Sb/Br); Manufacturer: Texas Instruments; Temp Coeff(Typ)(ppm/ degree C): 34; VO Adj(Max)(V): 36; Min Iz for Regulation(uA): 600; VO Adj(Min)(V): 2.495; Rating: Military; SubFamily: Shunt Voltage Reference; Iout/Iz(Max)(mA): 100; Temp Coeff(Max)(ppm/ degree C): 92; Initial Accuracy @ 25/deg C(%): 2; ComponentLink2URL: http://www.ti.com/general/docs/lit/getliterature.tsp?genericPartNumber=TL431&fileType=pdf; Code_JEDEC: TO-236; PackageDescription: 3-Pin Plastic Small Outline, Body 2.92 x 1.3 mm, Pitch 0.95 mm; ComponentLink3Description: Package Specification; Mounting Technology: Surface Mount; PartNumber: TL431QDBZT; PackageVersion: 4203227/B; DatasheetVersion: SLVS543M; ComponentLink1Description: Manufacturer URL; Eco-Plan: Green (RoHS & no Sb/Br); PackageReference: DBZ0003A; ComponentLink3URL: http://www.ti.com/litv/pdf/mpds108a; ComponentLink1URL: http://www.ti.com/; ComponentLink2Description: Datasheet

## Sheet Scheet_MCUBOOT_esp32s3.SchDoc
size A4; SheetNumber: 7; SheetTotal: 7
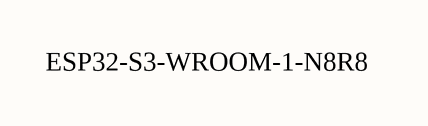
[diagram p6: Scheet_MCUBOOT_esp32s3.SchDoc]

### Notes on the sheet
- ESP32-S3-WROOM-1-N8R8

## Nets that join several sheets
3V3: Sheet1 (R?#9.2), Sheet_MCU (9 pins), Sheet_CURRENT_MEAS (C?#11.2 C?#12.2 U?#4.6 U?#5.6), Sheet_POWER_SUPPL (C?#16.1 U?#6.2 U?#6.4)
5V: Sheet1 (B?#1.A3 B?#1.C4 C?#1.2), Sheet_POWER_SUPPL (5 pins)
GND: Sheet1 (8 pins), Sheet_MCU (17 pins), Sheet_MCU_BOOT (10 pins), Sheet_CURRENT_MEAS (8 pins), Sheet_POWER_SUPPL (8 pins), Sheet_RES_MEAS (5 pins)
V_PV: Sheet1 (F?.1 F?.3 R?#3.2), Sheet_POWER_SUPPL (B?#2.2 B?#2.3 C?#14.1 C?#15.1), Sheet_RES_MEAS (R?#24.2)
BAT: Sheet1 (R?#4.2 R?#7.2), Sheet_CURRENT_MEAS (U?#4.1), Sheet_RES_MEAS (Q?#6.1 Q?#6.2 Q?#6.3 R?#22.2)
BOOT_RXD: Sheet_MCU (U?#2.25), Sheet_MCU_BOOT (U?#3.25)
BOOT_TXD: Sheet_MCU (U?#2.24), Sheet_MCU_BOOT (U?#3.26)
EN: Sheet_MCU (C?#5.2 R?#11.1 U?#2.3), Sheet_MCU_BOOT (Q?#3.3)
ESP_PWM_B: Sheet1 (B?#1.A4), Sheet_MCU (U?#2.12)
ESP_PWM_T: Sheet1 (B?#1.B4), Sheet_MCU (U?#2.11)
GAN_TEMP_MEAS: Sheet1 (R?#9.1 R?#10.2), Sheet_MCU (U?#2.27)
GPIO_9: Sheet_MCU (U?#2.15), Sheet_MCU_BOOT (Q?#4.3)
IN_CURRENT_SENS+: Sheet1 (F?.2 F?.4 R?#1.1), Sheet_CURRENT_MEAS (U?#5.8)
IN_CURRENT_SENS-: Sheet1 (Q?#1.3 Q?#1.5 R?#1.2), Sheet_CURRENT_MEAS (U?#5.1)
IN_VOLTAGE_MEAS: Sheet1 (R?#3.1 R?#6.2), Sheet_MCU (U?#1.6)
NetU?#2_8: Sheet_MCU (U?#2.8), Sheet_CURRENT_MEAS (U?#5.5)
NetU?#2_9: Sheet_MCU (U?#2.9), Sheet_CURRENT_MEAS (U?#4.5)
OUT_CURRENT_SENS+: Sheet1 (L?#1.2 R?#4.1), Sheet_CURRENT_MEAS (U?#4.8)
OUT_VOLTAGE_MEAS: Sheet1 (R?#7.1 R?#8.2), Sheet_MCU (U?#1.7)
RES_MEAS_CONTROL: Sheet_MCU (U?#1.4), Sheet_RES_MEAS (Q?#5.1)